# EAGLE design usb_to_uart_converter (EAGLE 6.2)
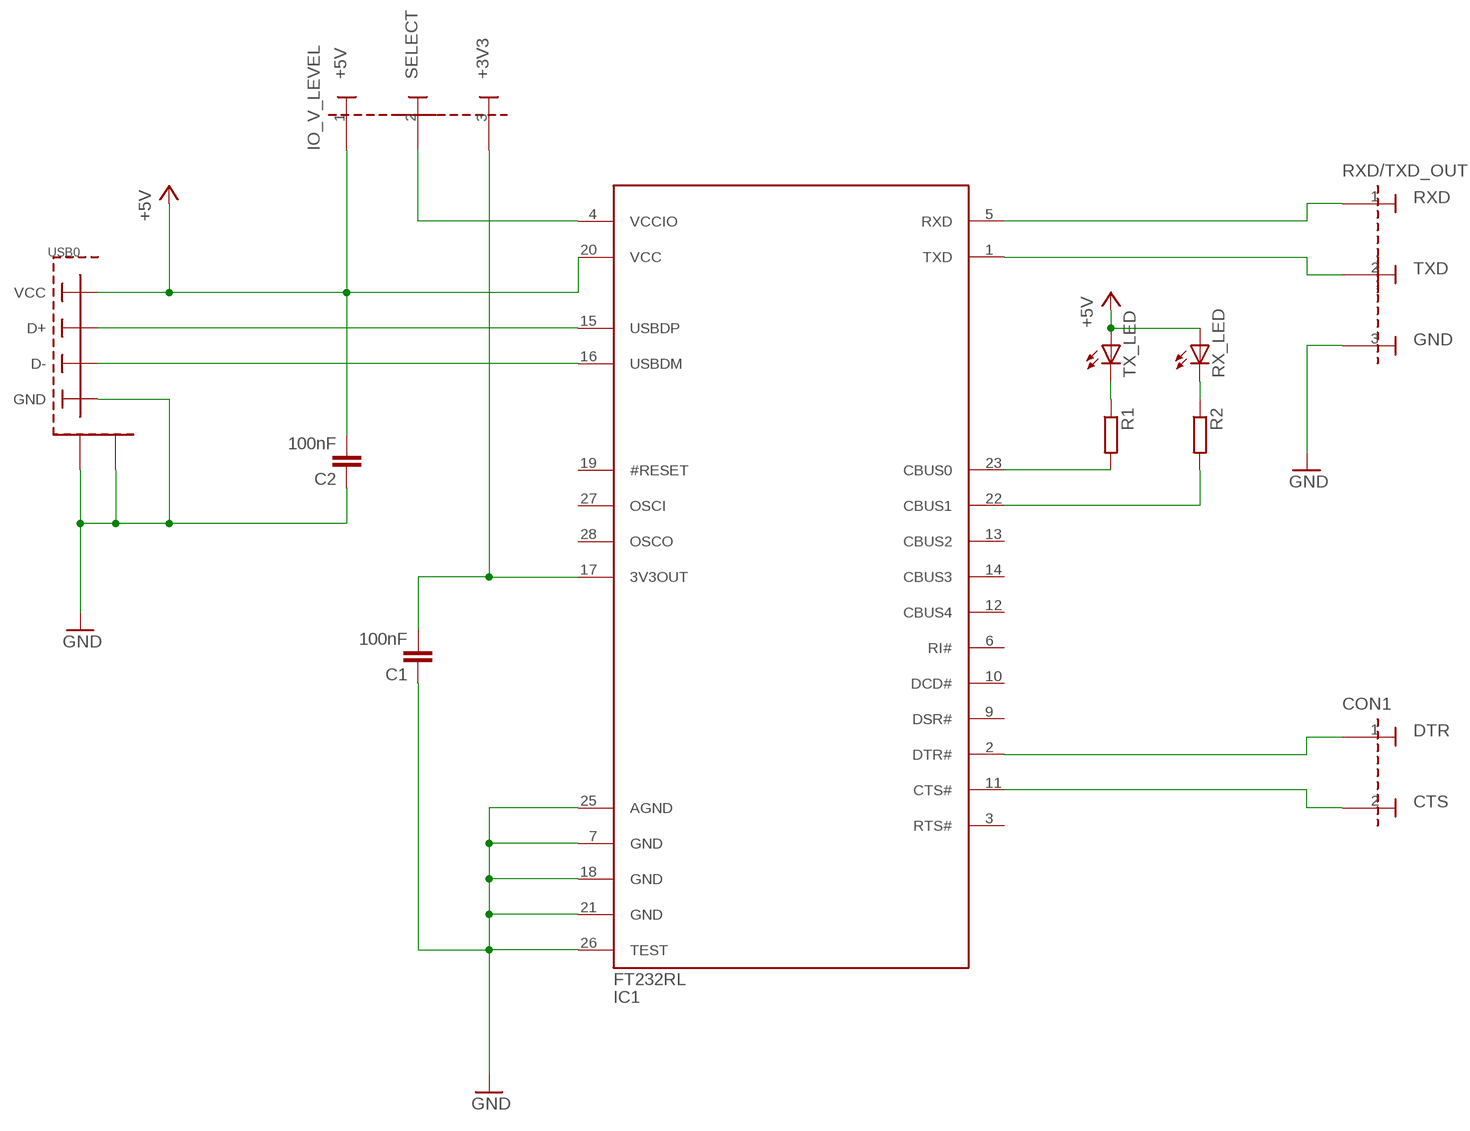
[diagram p0: schematic, sheet 1]

## Parts
C1  100nF  C-EUC0805  [C0805]
C2  100nF  C-EUC0805  [C0805]
CON1  CONNECTOR_2PIN1X2  [1X2_GENERIC]
IC1  FT232RL  [SSOP28]
IO_V_LEVEL  CONNECTOR_3PINWITH_LABELS  [1X3_GENERIC_WITH_LABELS]
R1  R-EU_R0805  [R0805]
R2  R-EU_R0805  [R0805]
RX_LED  LED_LIBCHIPLED_0805  [CHIPLED_0805]
RXD/TXD_OUT  CONNECTOR_3PINWITH_LABELS  [1X3_GENERIC_WITH_LABELS]
TX_LED  LED_LIBCHIPLED_0805  [CHIPLED_0805]
USB0  USB-BWUERTH-ELECTRONIC-USB-B  [USB-B-THROUGH-HOLE]

## Nets
+5V: C2.2 IC1.20(VCC) IO_V_LEVEL.1 RX_LED.A TX_LED.A USB0.VCC
GND: C1.1 C2.1 IC1.7(GND) IC1.18(GND) IC1.21(GND) IC1.25(AGND) IC1.26(TEST) RXD/TXD_OUT.3 USB0.GND USB0.SHIELD USB0.SHIELD@2(SHIELD)
N$2: IC1.15(USBDP) USB0.D+
N$3: IC1.16(USBDM) USB0.D-
N$4: C1.2 IC1.17(3V3OUT) IO_V_LEVEL.3
N$5: IC1.4(VCCIO) IO_V_LEVEL.2
N$6: IC1.5(RXD) RXD/TXD_OUT.1
N$7: IC1.1(TXD) RXD/TXD_OUT.2
N$8: R1.1 TX_LED.C
N$9: R2.1 RX_LED.C
N$10: IC1.23(CBUS0) R1.2
N$11: IC1.22(CBUS1) R2.2
N$13: CON1.1 IC1.2(DTR#)
N$14: CON1.2 IC1.11(CTS#)
Unconnected: IC1.3(RTS#) IC1.6(RI#) IC1.9(DSR#) IC1.10(DCD#) IC1.12(CBUS4) IC1.13(CBUS2) IC1.14(CBUS3) IC1.19(#RESET) IC1.27(OSCI) IC1.28(OSCO)

## Library data of the parts
C1 C2 = RC_and_L:C-EU: CAPACITOR, European symbol
CON1 = connectors:CONNECTOR_2PIN; PIN1: DTR; PIN2: CTS
IC1 = usb_uart:FT232RL: FTDI - FT232RL - IC, USB TO UART, SMD, SSOP28, 232; DATASHEET: http://www.farnell.com/datasheets/11529.pdf; FARNELL: http://fi.farnell.com/ftdi/ft232rl/ic-usb-to-uart-smd-ssop28-232/dp/1146032
IO_V_LEVEL = connectors:CONNECTOR_3PIN; PIN1: +5V; PIN2: SELECT; PIN3: +3V3
R1 R2 = RC_and_L:R-EU_: RESISTOR, European symbol
RX_LED TX_LED = usb_uart:LED_LIB: LED OSRAM: - CHIPLED LG R971, LG N971, LY N971, LG Q971, LY Q971, LO R971, LY R971 LH N974, LH R974 LS Q976, LO Q976, LY Q976 LO Q996 - Hyper CHIPLED LW Q18S LB Q993, LB Q99A, LB R99A - SideLED LS A670, LO A670, LY A670, LG A670, LP A670 LB A673, LV A673, LT A673, LW A673 LH A674 LY A675 LS A676, LA A676, LO A676, LY A676, LW A676 LS A679, LY A679, LG A679 - Hyper Micro SIDELED® LS Y876, LA Y876, LO Y876, LY Y876 LT Y87S - SmartLED LW L88C, LW L88S LB L89C, LB L89S, LG L890 LS L89K, LO L89K, LY L89K LS L896, LA L896, LO L896, LY L896 - TOPLED LS T670, LO T670, LY T670, LG T670, LP T670 LSG T670, LSP T670, LSY T670, LOP T670, LYG T670 LG T671, LOG T671, LSG T671 LB T673, LV T673, LT T673, LW T673 LH T674 LS T676, LA T676, LO T676, LY T676, LB T676, LH T676, LSB T676, LW T676 LB T67C, LV T67C, LT T67C, LS T67K, LO T67K, LY T67K, LW E67C LS E67B, LA E67B, LO E67B, LY E67B, LB E67C, LV E67C, LT E67C LW T67C LS T679, LY T679, LG T679 LS T770, LO T770, LY T770, LG T770, LP T770 LB T773, LV T773, LT T773, LW T773 LH T774 LS E675, LA E675, LY E675, LS T675 LS T776, LA T776, LO T776, LY T776, LB T776 LHGB T686 LT T68C, LB T68C - Hyper Mini TOPLED® LB M676 - Mini TOPLED Santana® LG M470 LS M47K, LO M47K, LY M47K Source: http://www.osram.convergy.de LUXEON: - LUMILED® LXK2-PW12-R00, LXK2-PW12-S00, LXK2-PW14-U00, LXK2-PW14-V00 LXK2-PM12-R00, LXK2-PM12-S00, LXK2-PM14-U00 LXK2-PE12-Q00, LXK2-PE12-R00, LXK2-PE12-S00, LXK2-PE14-T00, LXK2-PE14-U00 LXK2-PB12-K00, LXK2-PB12-L00, LXK2-PB12-M00, LXK2-PB14-N00, LXK2-PB14-P00, LXK2-PB14-Q00 LXK2-PR12-L00, LXK2-PR12-M00, LXK2-PR14-Q00, LXK2-PR14-R00 LXK2-PD12-Q00, LXK2-PD12-R00, LXK2-PD12-S00 LXK2-PH12-R00, LXK2-PH12-S00 LXK2-PL12-P00, LXK2-PL12-Q00, LXK2-PL12-R00 Source: www.luxeon.com KINGBRIGHT: KA-3528ASYC Source: www.kingbright.com
RXD/TXD_OUT = connectors:CONNECTOR_3PIN; PIN1: RXD; PIN2: TXD; PIN3: GND
USB0 = usb_uart:USB-B: USB, type B connector.; DATASHEET: http://www.farnell.com/datasheets/1442182.pdf; FARNELL: http://fi.farnell.com/jsp/search/productdetail.jsp?SKU=1642035

## Board
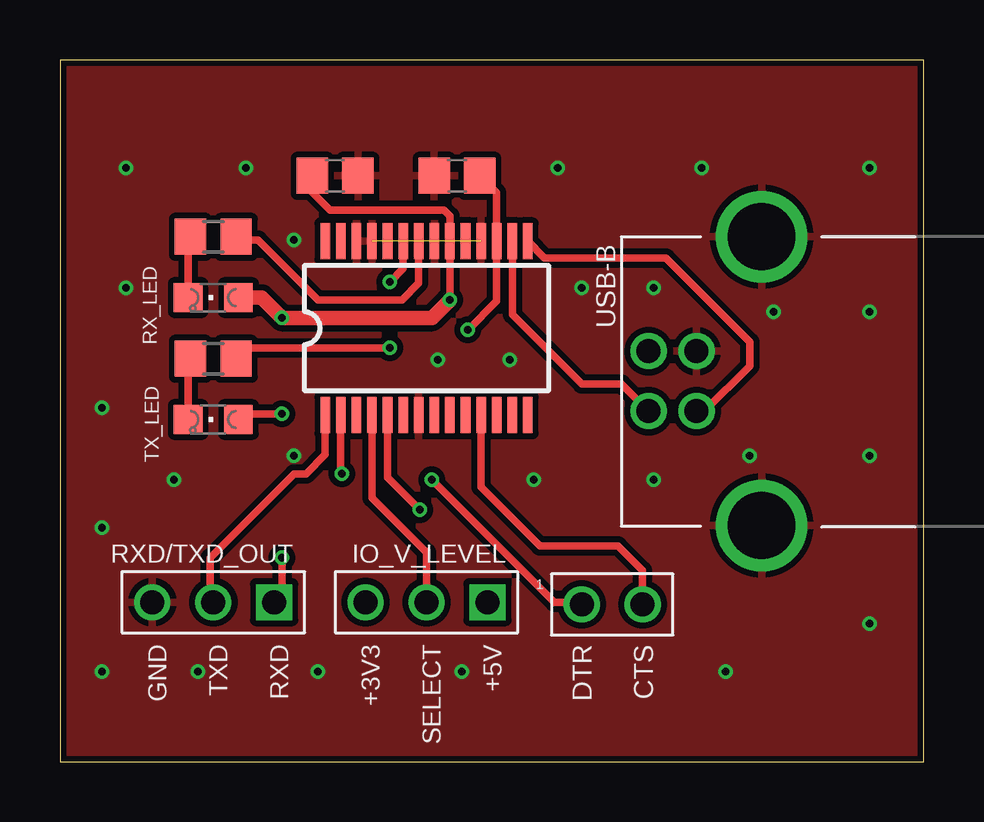
[diagram p1: board, top side]
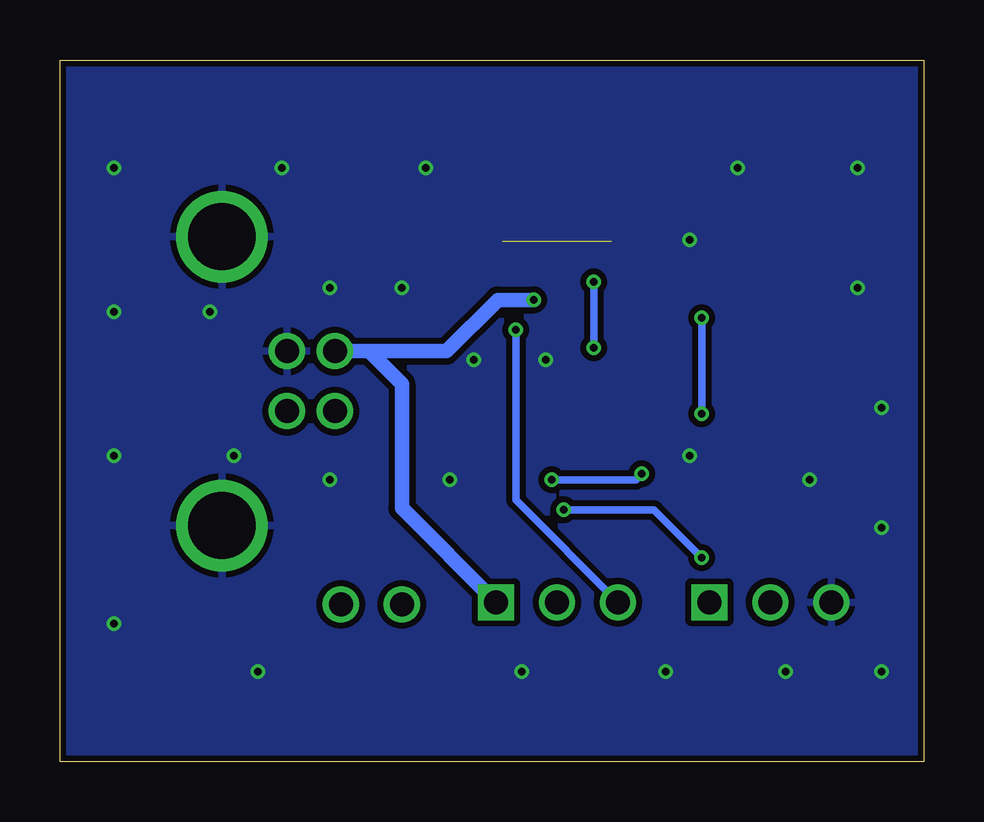
[diagram p2: board, bottom side, seen from below]

Size 36 x 29.25 mm. Coordinates in mm from the lower left corner, seen from the top.
Outline: 0,0 36,0 36,29.25 0,29.25 0,0
Copper layers (1*16): Top 0.035mm / dielectric 1.5mm / Bottom 0.035mm
Design rules: minimum track width 6mil, minimum drill 12mil, track to track 10mil, track to pad 10mil, pad to pad 6mil, via to via 6mil, smd to smd 0mil, copper to edge 10mil, drill to drill 10mil, minimum pad ring 10mil, minimum via ring 6mil, stop-mask expansion 2mil, vias tented up to drill 100mil, thermal gap 10mil

### Footprints (pad centres in the part's own frame; a part is rotated, then mirrored left to right if it is on the bottom)
C0805 = smd 1.3 x 1.5: 1 -0.95,0; 2 0.95,0
1X2_GENERIC = drill 1: 1 0,0; 2 2.54,0
SSOP28 = smd 0.4 x 1.5: 1 -4.225,-3.625; 2 -3.575,-3.625; 3 -2.925,-3.625; 4 -2.275,-3.625; 5 -1.625,-3.625; 6 -0.975,-3.625; 7 -0.325,-3.625; 8 0.325,-3.625; 9 0.975,-3.625; 10 1.625,-3.625; 11 2.275,-3.625; 12 2.925,-3.625; 13 3.575,-3.625; 14 4.225,-3.625; 15 4.225,3.625; 16 3.575,3.625; 17 2.925,3.625; 18 2.275,3.625; 19 1.625,3.625; 20 0.975,3.625; 21 0.325,3.625; 22 -0.325,3.625; 23 -0.975,3.625; 24 -1.625,3.625; 25 -2.275,3.625; 26 -2.925,3.625; 27 -3.575,3.625; 28 -4.225,3.625
1X3_GENERIC_WITH_LABELS = drill 1 square: 1 -1.27,0 | drill 1: 2 1.27,0; 3 3.81,0
R0805 = smd 1.3 x 1.5: 1 -0.95,0; 2 0.95,0
CHIPLED_0805 = smd 1.2 x 1.2: A 0,-1.05; C 0,1.05
USB-B-THROUGH-HOLE = drill 1: D+ 7.27,-2.71; D- 7.27,-4.71; GND 4.77,-2.71; VCC 4.77,-4.71 | drill 2.8: SHIELD 0,0; SHIELD@2 12.04,0

### Placement (x,y rotation side)
C1  16.55,24.42 0 top
C2  11.47,24.42 180 top
CON1  21.75,6.55 0 top
IC1  15.28,18.07 0 top
IO_V_LEVEL  16.55,6.64 180 top
R1  6.39,16.8 0 top
R2  6.39,21.88 0 top
RX_LED  6.39,19.34 90 top
RXD/TXD_OUT  7.66,6.64 180 top
TX_LED  6.39,14.26 90 top
USB0  29.25,21.88 270 top

### Tracks (layer width: path | path; a pad name or v marks a point on that pad's centre or on a via)
+5V  (via drill 0.3)
  Top 0.305: v16.25,19.25 IC1.20 16.26,22.75 16,23 11.25,23 10.5,23.75 10.5,24.4 C2.2 | v9.25,14.5 7.68,14.5 TX_LED.A
  Top 0.61: RX_LED.A 8.41,19.34 v9.25,18.5 15.5,18.5 v16.25,19.25
  Bottom 0.305: USB0.VCC 23.11,17.11 | v9.25,18.5 v9.25,14.5
  Bottom 0.61: 23.11,17.11 21.75,15.75 21.75,10.57 IO_V_LEVEL.1 | USB0.VCC 19.89,17.11 17.75,19.25 v16.25,19.25
GND  (via drill 0.3)  (2 unrouted)
  other vias: 2.75,24.75 7.75,24.75 20.75,24.75 26.75,24.75 33.75,24.75 33.75,18.75 33.75,12.75 33.75,5.75 27.75,3.75 16.75,3.75 10.75,3.75 5.75,3.75 1.75,3.75 1.75,9.75 1.75,14.75 2.75,19.75 4.75,11.75 9.75,12.75 15.75,16.75 18.75,16.75 19.75,11.75 21.75,19.75 24.75,19.75 24.75,11.75 28.75,12.75 29.75,18.75 9.75,21.75
  pour Bottom: -2.25,34.5 43.75,34.5 43.75,-7.25 -2.25,-7.25
  pour Top: -1.5,32.75 -1.5,-3 41.75,-3 41.75,32 0,32 0,33 -1.5,33
N$2
  Top 0.305: USB0.D+ 26.86,14.61 28.75,16.5 28.75,17.5 25.25,21 20.2,21 IC1.15
N$3
  Top 0.305: IC1.16 18.85,18.64 21.75,15.75 23.4,15.75 USB0.D-
N$4  (via drill 0.3)
  Top 0.305: C1.2 18.2,23.71 IC1.17 18.2,19.2 v17,18
  Bottom 0.305: v17,18 17,10.9 IO_V_LEVEL.3
N$5
  Top 0.305: IO_V_LEVEL.2 15.28,8.72 13,11 13.01,11.01 IC1.4
N$6  (via drill 0.3)
  Top 0.305: IC1.5 13.66,11.85 v15,10.5 | v9.25,8.5 9.25,6.96 RXD/TXD_OUT.1
  Bottom 0.305: v15,10.5 11.25,10.5 v9.25,8.5
N$7
  Top 0.305: IC1.1 11.05,12.8 10.25,12 9.75,12 6.25,8.5 6.25,6.78 RXD/TXD_OUT.2
N$8
  Top 0.305: TX_LED.C 5.34,16.7 R1.1
N$9
  Top 0.305: RX_LED.C 5.34,21.78 R2.1
N$10  (via drill 0.3)
  Top 0.305: IC1.23 14.3,20.55 v13.75,20 | v13.75,17.25 7.79,17.25 R1.2
  Bottom 0.305: v13.75,20 v13.75,17.25
N$11
  Top 0.305: IC1.22 14.95,19.95 14.25,19.25 10.75,19.25 8.25,21.75 7.47,21.75 R2.2
N$13  (via drill 0.3)
  Top 0.305: v15.5,11.75 20.61,6.64 21.66,6.64 CON1.1 | IC1.2 11.7,12.04 v11.75,12
  Bottom 0.305: v15.5,11.75 12,11.75 v11.75,12
N$14
  Top 0.305: IC1.11 17.55,11.45 20,9 23.25,9 24.29,7.96 CON1.2